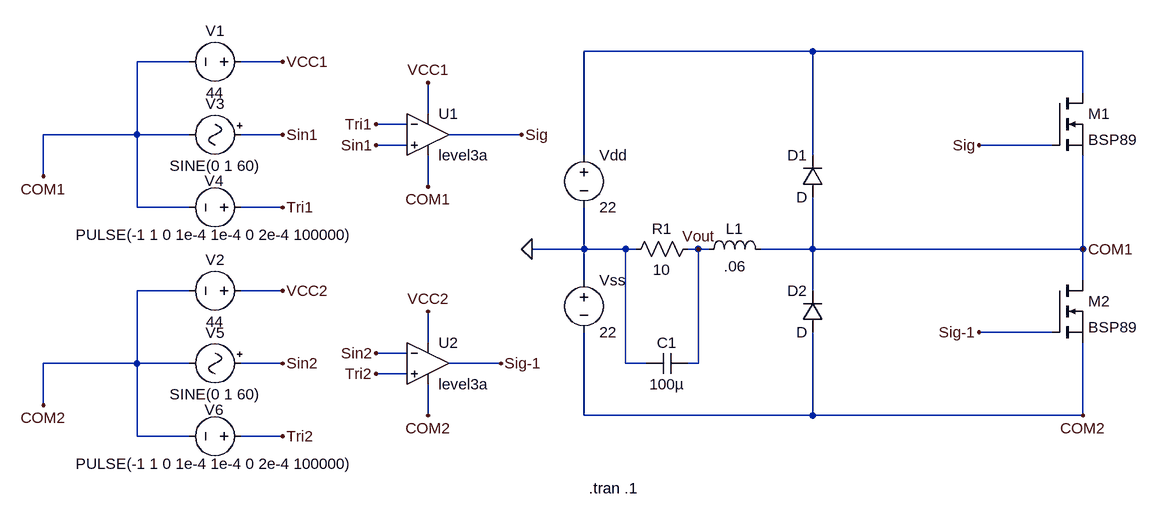
[diagram p0: schematic final_single_phase_inv.asc]
final_single_phase_inv.asc, the LTspice schematic file:
Version 4
SHEET 1 2320 1200
WIRE 256 304 -96 304
WIRE 672 304 256 304
WIRE -704 320 -784 320
WIRE -560 320 -624 320
WIRE 672 368 672 304
WIRE -336 400 -336 352
WIRE -368 416 -416 416
WIRE -784 432 -784 320
WIRE -784 432 -928 432
WIRE -704 432 -784 432
WIRE -560 432 -624 432
WIRE -192 432 -304 432
WIRE -368 448 -416 448
WIRE 624 448 512 448
WIRE -96 464 -96 304
WIRE 256 464 256 304
WIRE -928 496 -928 432
WIRE -336 512 -336 464
WIRE -784 544 -784 432
WIRE -704 544 -784 544
WIRE -560 544 -624 544
WIRE -96 608 -96 544
WIRE -96 608 -176 608
WIRE -32 608 -96 608
WIRE -16 608 -32 608
WIRE 80 608 64 608
WIRE 96 608 80 608
WIRE 256 608 256 528
WIRE 256 608 176 608
WIRE 672 608 672 464
WIRE 672 608 256 608
WIRE -96 656 -96 608
WIRE 672 656 672 608
WIRE -704 672 -784 672
WIRE -560 672 -624 672
WIRE 256 672 256 608
WIRE 624 736 512 736
WIRE -336 752 -336 704
WIRE -368 768 -416 768
WIRE -784 784 -784 672
WIRE -784 784 -928 784
WIRE -704 784 -784 784
WIRE -560 784 -624 784
WIRE -224 784 -304 784
WIRE -32 784 -32 608
WIRE 0 784 -32 784
WIRE 80 784 80 608
WIRE 80 784 64 784
WIRE -368 800 -416 800
WIRE -928 848 -928 784
WIRE -336 864 -336 816
WIRE -96 864 -96 736
WIRE 256 864 256 736
WIRE 256 864 -96 864
WIRE 672 864 672 752
WIRE 672 864 256 864
WIRE -784 896 -784 784
WIRE -704 896 -784 896
WIRE -560 896 -624 896
FLAG -176 608 0
FLAG -416 448 Sin1
FLAG -416 416 Tri1
FLAG -416 800 Tri2
FLAG -416 768 Sin2
FLAG -192 432 Sig
FLAG -224 784 Sig-1
FLAG -336 352 VCC1
FLAG -336 704 VCC2
FLAG -336 512 COM1
FLAG -336 864 COM2
FLAG 672 608 COM1
FLAG 672 864 COM2
FLAG -560 320 VCC1
FLAG -560 432 Sin1
FLAG -560 544 Tri1
FLAG -928 496 COM1
FLAG 80 608 Vout
FLAG -560 672 VCC2
FLAG -560 784 Sin2
FLAG -560 896 Tri2
FLAG -928 848 COM2
FLAG 512 448 Sig
FLAG 512 736 Sig-1
SYMBOL voltage -96 448 R0
SYMATTR InstName Vdd
SYMATTR Value 22
SYMBOL voltage -96 640 R0
SYMATTR InstName Vss
SYMATTR Value 22
SYMBOL Diode 272 528 R180
WINDOW 0 24 64 Left 2
WINDOW 3 24 0 Left 2
SYMATTR InstName D1
SYMBOL Diode 272 736 R180
WINDOW 0 24 64 Left 2
WINDOW 3 24 0 Left 2
SYMATTR InstName D2
SYMBOL nmos 624 368 R0
SYMATTR InstName M1
SYMATTR Value BSP89
SYMBOL nmos 624 656 R0
SYMATTR InstName M2
SYMATTR Value BSP89
SYMBOL Res 80 592 R90
WINDOW 0 0 56 VBottom 2
WINDOW 3 32 56 VTop 2
SYMATTR InstName R1
SYMATTR Value 10
SYMBOL ind 80 624 R270
WINDOW 0 32 56 VTop 2
WINDOW 3 5 56 VBottom 2
SYMATTR InstName L1
SYMATTR Value .06
SYMBOL cap 64 768 R90
WINDOW 0 0 32 VBottom 2
WINDOW 3 32 32 VTop 2
SYMATTR InstName C1
SYMATTR Value 100µ
SYMBOL voltage -608 320 R90
WINDOW 0 -32 56 VBottom 2
WINDOW 3 32 56 VTop 2
WINDOW 123 0 0 Left 0
WINDOW 39 0 0 Left 0
SYMATTR InstName V1
SYMATTR Value 44
SYMBOL signal -608 432 R90
WINDOW 0 -32 56 VBottom 2
WINDOW 3 32 56 VTop 2
WINDOW 123 0 0 Left 0
WINDOW 39 0 0 Left 0
SYMATTR InstName V3
SYMATTR Value SINE(0 1 60)
SYMBOL voltage -608 544 R90
WINDOW 123 0 0 Left 0
WINDOW 39 0 0 Left 0
WINDOW 0 -41 43 VRight 2
WINDOW 3 42 -161 VRight 2
SYMATTR InstName V4
SYMATTR Value PULSE(-1 1 0 1e-4 1e-4 0 2e-4 100000)
SYMBOL voltage -608 672 R90
WINDOW 0 -32 56 VBottom 2
WINDOW 3 32 56 VTop 2
WINDOW 123 0 0 Left 0
WINDOW 39 0 0 Left 0
SYMATTR InstName V2
SYMATTR Value 44
SYMBOL signal -608 784 R90
WINDOW 0 -32 56 VBottom 2
WINDOW 3 32 56 VTop 2
WINDOW 123 0 0 Left 0
WINDOW 39 0 0 Left 0
SYMATTR InstName V5
SYMATTR Value SINE(0 1 60)
SYMBOL voltage -608 896 R90
WINDOW 123 0 0 Left 0
WINDOW 39 0 0 Left 0
WINDOW 0 -41 43 VRight 2
WINDOW 3 42 -161 VRight 2
SYMATTR InstName V6
SYMATTR Value PULSE(-1 1 0 1e-4 1e-4 0 2e-4 100000)
SYMBOL OpAmps/UniversalOpAmp3 -336 432 R0
SYMATTR InstName U1
SYMBOL OpAmps/UniversalOpAmp3 -336 784 R0
SYMATTR InstName U2
TEXT -88 976 Left 2 !.tran .1

The netlist it stands for:
* final_single_phase_inv.asc
Vdd N001 0 22
Vss 0 COM2 22
D1 COM1 N001 D
D2 COM2 COM1 D
M1 N001 Sig COM1 COM1 BSP89
M2 COM1 Sig-1 COM2 COM2 BSP89
R1 Vout 0 10
L1 Vout COM1 .06
C1 Vout 0 100µ
V1 VCC1 COM1 44
V3 Sin1 COM1 SINE(0 1 60)
V4 Tri1 COM1 PULSE(-1 1 0 1e-4 1e-4 0 2e-4 100000)
V2 VCC2 COM2 44
V5 Sin2 COM2 SINE(0 1 60)
V6 Tri2 COM2 PULSE(-1 1 0 1e-4 1e-4 0 2e-4 100000)
XU1 Sin1 Tri1 VCC1 COM1 Sig level3a  ; pins In+ In- V+ V- OUT
XU2 Tri2 Sin2 VCC2 COM2 Sig-1 level3a  ; pins In+ In- V+ V- OUT
.model D D
.lib standard.dio
.model NMOS NMOS
.model PMOS PMOS
.lib standard.mos
.tran .1
.backanno
.end